# Altium schematic sheet sdb.SchDoc
size A4
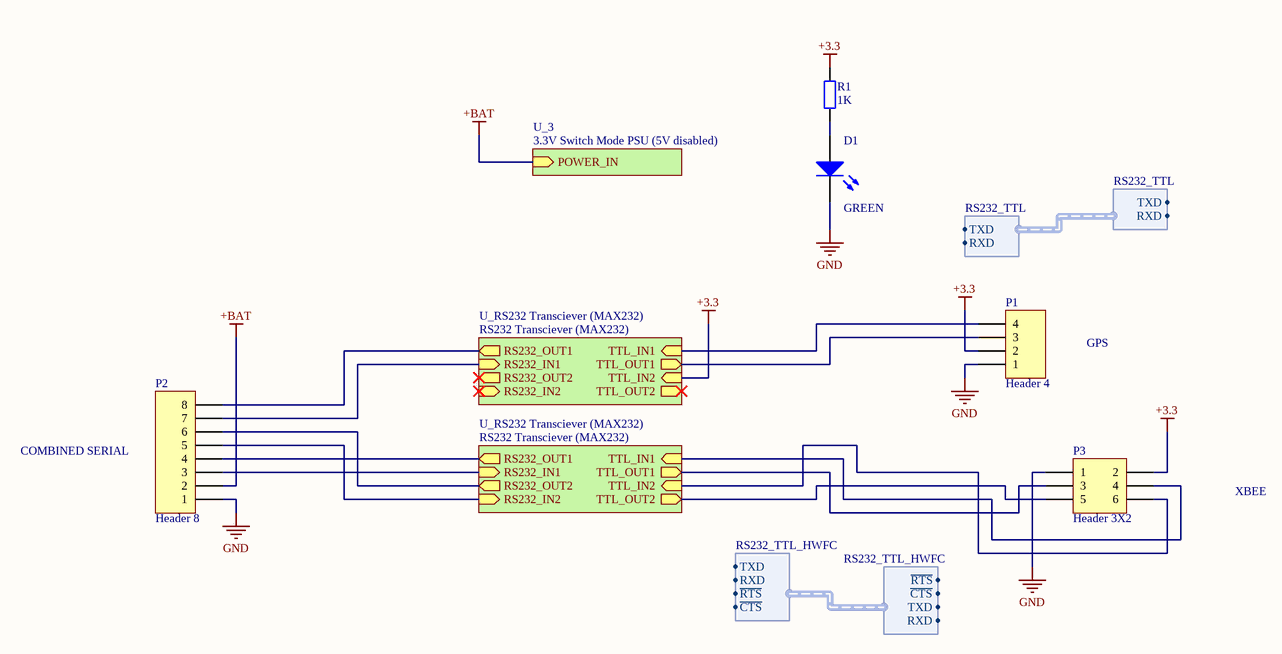
[diagram p0: sdb.SchDoc]

## Parts
D1  value GREEN  [LGQ971]
P1  Header 4  [HDR1X4]
P2  Header 8  [HDR1X8]
P3  Header 3X2  [HDR2X3]
R1  value 1K  [R0603]  (hidden comment: Res)

## Sub-sheets
U_3 = 3.3V Switch Mode PSU (5V disabled): POWER_IN (in)
U_RS232 Transciever (MAX232) = RS232 Transciever (MAX232): TTL_IN1 (in), RS232_OUT1 (out), TTL_IN2 (in), RS232_OUT2 (out), RS232_IN1 (in), RS232_IN2 (in), TTL_OUT1 (out), TTL_OUT2 (out)
U_RS232 Transciever (MAX232) = RS232 Transciever (MAX232): TTL_IN1 (in), RS232_OUT1 (out), TTL_IN2 (in), RS232_OUT2 (out), RS232_IN1 (in), RS232_IN2 (in), TTL_OUT1 (out), TTL_OUT2 (out)

## Harnesses
RS232_TTL: RXD, TXD
RS232_TTL_HWFC: ~{CTS}, ~{RTS}, RXD, TXD

## Nets
+3.3: P1.2 P3.2 R1.2 ; sheet U_RS232 Transciever (MAX232)/TTL_IN2
+BAT: P2.2 ; sheet U_3/POWER_IN
GND: D1.2(K) P1.1 P2.1 P3.1
NetD1_1: D1.1(A) R1.1
NetP1_3: P1.3 ; sheet U_RS232 Transciever (MAX232)/TTL_OUT1
NetP1_4: P1.4 ; sheet U_RS232 Transciever (MAX232)/TTL_IN1
NetP2_3: P2.3 ; sheet U_RS232 Transciever (MAX232)/RS232_IN1
NetP2_4: P2.4 ; sheet U_RS232 Transciever (MAX232)/RS232_OUT1
NetP2_5: P2.5 ; sheet U_RS232 Transciever (MAX232)/RS232_IN2
NetP2_6: P2.6 ; sheet U_RS232 Transciever (MAX232)/RS232_OUT2
NetP2_7: P2.7 ; sheet U_RS232 Transciever (MAX232)/RS232_IN1
NetP2_8: P2.8 ; sheet U_RS232 Transciever (MAX232)/RS232_OUT1
NetP3_3: P3.3 ; sheet U_RS232 Transciever (MAX232)/TTL_OUT1
NetP3_4: P3.4 ; sheet U_RS232 Transciever (MAX232)/TTL_IN1
NetP3_5: P3.5 ; sheet U_RS232 Transciever (MAX232)/TTL_OUT2
NetP3_6: P3.6 ; sheet U_RS232 Transciever (MAX232)/TTL_IN2

## Notes on the sheet
- GPS
- COMBINED SERIAL
- XBEE

## Library data of the parts
D1 = LED2: Typical RED, GREEN, YELLOW, AMBER GaAs LED; farnell: 1226372
P1 = Header 4: Header, 4-Pin; LatestRevisionDate: 17-Jul-2002; LatestRevisionNote: Re-released for DXP Platform.; Publisher: Altium Limited
P2 = Header 8: Header, 8-Pin; LatestRevisionDate: 17-Jul-2002; LatestRevisionNote: Re-released for DXP Platform.; Publisher: Altium Limited
P3 = Header 3X2: Header, 3-Pin, Dual row; LatestRevisionDate: 17-Jul-2002; LatestRevisionNote: Re-released for DXP Platform.; Publisher: Altium Limited
R1 = Res2: Resistor; farnell: 9330380